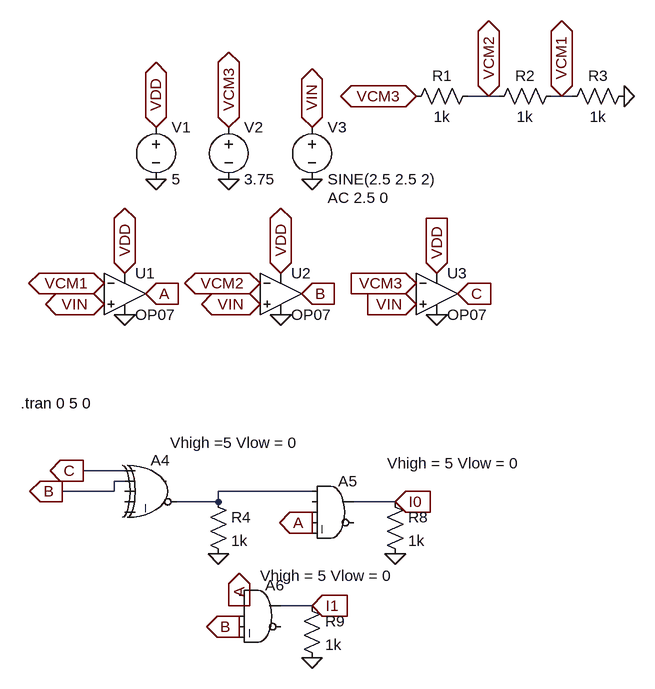
[diagram p0: schematic 2 BIT ADC.asc]
2 BIT ADC.asc, the LTspice schematic file:
Version 4.1
SHEET 1 1168 936
WIRE 560 48 528 48
WIRE 576 48 560 48
WIRE 672 48 656 48
WIRE 688 48 672 48
WIRE 0 624 -64 624
WIRE 0 640 -16 640
WIRE -16 656 -16 640
WIRE -16 656 -96 656
WIRE 288 656 144 656
WIRE 144 672 144 656
WIRE 144 672 80 672
WIRE 416 672 352 672
WIRE 288 832 240 832
FLAG 48 96 VDD
IOPIN 48 96 BiDir
FLAG 160 96 VCM3
IOPIN 160 96 BiDir
FLAG 448 48 VCM3
IOPIN 448 48 BiDir
FLAG 768 48 0
FLAG 288 96 VIN
IOPIN 288 96 BiDir
FLAG -32 368 VIN
IOPIN -32 368 BiDir
FLAG 208 368 VIN
IOPIN 208 368 BiDir
FLAG 448 368 VIN
IOPIN 448 368 In
FLAG 48 176 0
FLAG 160 176 0
FLAG 288 176 0
FLAG 672 48 VCM1
IOPIN 672 48 BiDir
FLAG 560 48 VCM2
IOPIN 560 48 BiDir
FLAG -32 336 VCM1
IOPIN -32 336 BiDir
FLAG 208 336 VCM2
IOPIN 208 336 BiDir
FLAG 448 336 VCM3
IOPIN 448 336 In
FLAG 32 352 A
IOPIN 32 352 In
FLAG 272 352 B
IOPIN 272 352 In
FLAG 512 352 C
IOPIN 512 352 In
FLAG -96 656 B
IOPIN -96 656 Out
FLAG -64 624 C
IOPIN -64 624 Out
FLAG 144 752 0
FLAG 288 704 A
IOPIN 288 704 Out
FLAG 416 752 0
FLAG 416 672 I0
IOPIN 416 672 In
FLAG 288 912 0
FLAG 176 864 B
IOPIN 176 864 Out
FLAG 176 832 A
IOPIN 176 832 Out
FLAG 288 832 I1
IOPIN 288 832 In
FLAG 0 384 0
FLAG 240 384 0
FLAG 480 384 0
FLAG 0 320 VDD
IOPIN 0 320 BiDir
FLAG 240 320 VDD
IOPIN 240 320 BiDir
FLAG 480 320 VDD
IOPIN 480 320 In
SYMBOL voltage 48 80 R0
WINDOW 123 0 0 Left 0
WINDOW 39 0 0 Left 0
SYMATTR InstName V1
SYMATTR Value 5
SYMBOL voltage 160 80 R0
WINDOW 123 0 0 Left 0
WINDOW 39 0 0 Left 0
SYMATTR InstName V2
SYMATTR Value 3.75
SYMBOL voltage 288 80 R0
WINDOW 123 24 124 Left 2
WINDOW 39 0 0 Left 0
SYMATTR Value2 AC 2.5 0
SYMATTR InstName V3
SYMATTR Value SINE(2.5 2.5 2)
SYMBOL res 544 32 R90
WINDOW 0 0 56 VBottom 2
WINDOW 3 32 56 VTop 2
SYMATTR InstName R1
SYMATTR Value 1k
SYMBOL res 672 32 R90
WINDOW 0 0 56 VBottom 2
WINDOW 3 32 56 VTop 2
SYMATTR InstName R2
SYMATTR Value 1k
SYMBOL res 784 32 R90
WINDOW 0 0 56 VBottom 2
WINDOW 3 32 56 VTop 2
SYMATTR InstName R3
SYMATTR Value 1k
SYMBOL Digital\\xor 48 592 R0
WINDOW 3 22 -11 Left 2
SYMATTR Value Vhigh =5 Vlow = 0
SYMATTR InstName A4
SYMBOL Digital\\and 320 624 R0
WINDOW 3 84 -11 Left 2
SYMATTR Value Vhigh = 5 Vlow = 0
SYMATTR InstName A5
SYMBOL res 400 656 R0
SYMATTR InstName R8
SYMATTR Value 1k
SYMBOL Digital\\and 208 784 R0
WINDOW 3 0 2 Left 2
SYMATTR Value Vhigh = 5 Vlow = 0
SYMATTR InstName A6
SYMBOL res 272 816 R0
SYMATTR InstName R9
SYMATTR Value 1k
SYMBOL res 128 656 R0
SYMATTR InstName R4
SYMATTR Value 1k
SYMBOL OpAmps\\OP07 0 288 R0
SYMATTR InstName U1
SYMBOL OpAmps\\OP07 240 288 R0
SYMATTR InstName U2
SYMBOL OpAmps\\OP07 480 288 R0
SYMATTR InstName U3
TEXT -160 520 Left 2 !.tran 0 5 0

The netlist it stands for:
* 2 BIT ADC.asc
V1 VDD 0 5
V2 VCM3 0 3.75
V3 VIN 0 SINE(2.5 2.5 2) AC 2.5 0
R1 VCM2 VCM3 1k
R2 VCM1 VCM2 1k
R3 0 VCM1 1k
A4 C B 0 0 0 N001 0 0 XOR Vhigh =5 Vlow = 0
A5 N001 0 0 A 0 0 I0 0 AND Vhigh = 5 Vlow = 0
R8 I0 0 1k
A6 0 A 0 B 0 0 I1 0 AND Vhigh = 5 Vlow = 0
R9 I1 0 1k
R4 N001 0 1k
X§U1 VIN VCM1 VDD 0 A LT1001  ; OP07, pins In+ In- V+ V- OUT
X§U2 VIN VCM2 VDD 0 B LT1001  ; OP07, pins In+ In- V+ V- OUT
X§U3 VIN VCM3 VDD 0 C LT1001  ; OP07, pins In+ In- V+ V- OUT
.tran 0 5 0
.lib LTC.lib
.backanno
.end